# EAGLE schematic GoomWave (EAGLE 9.3.2)
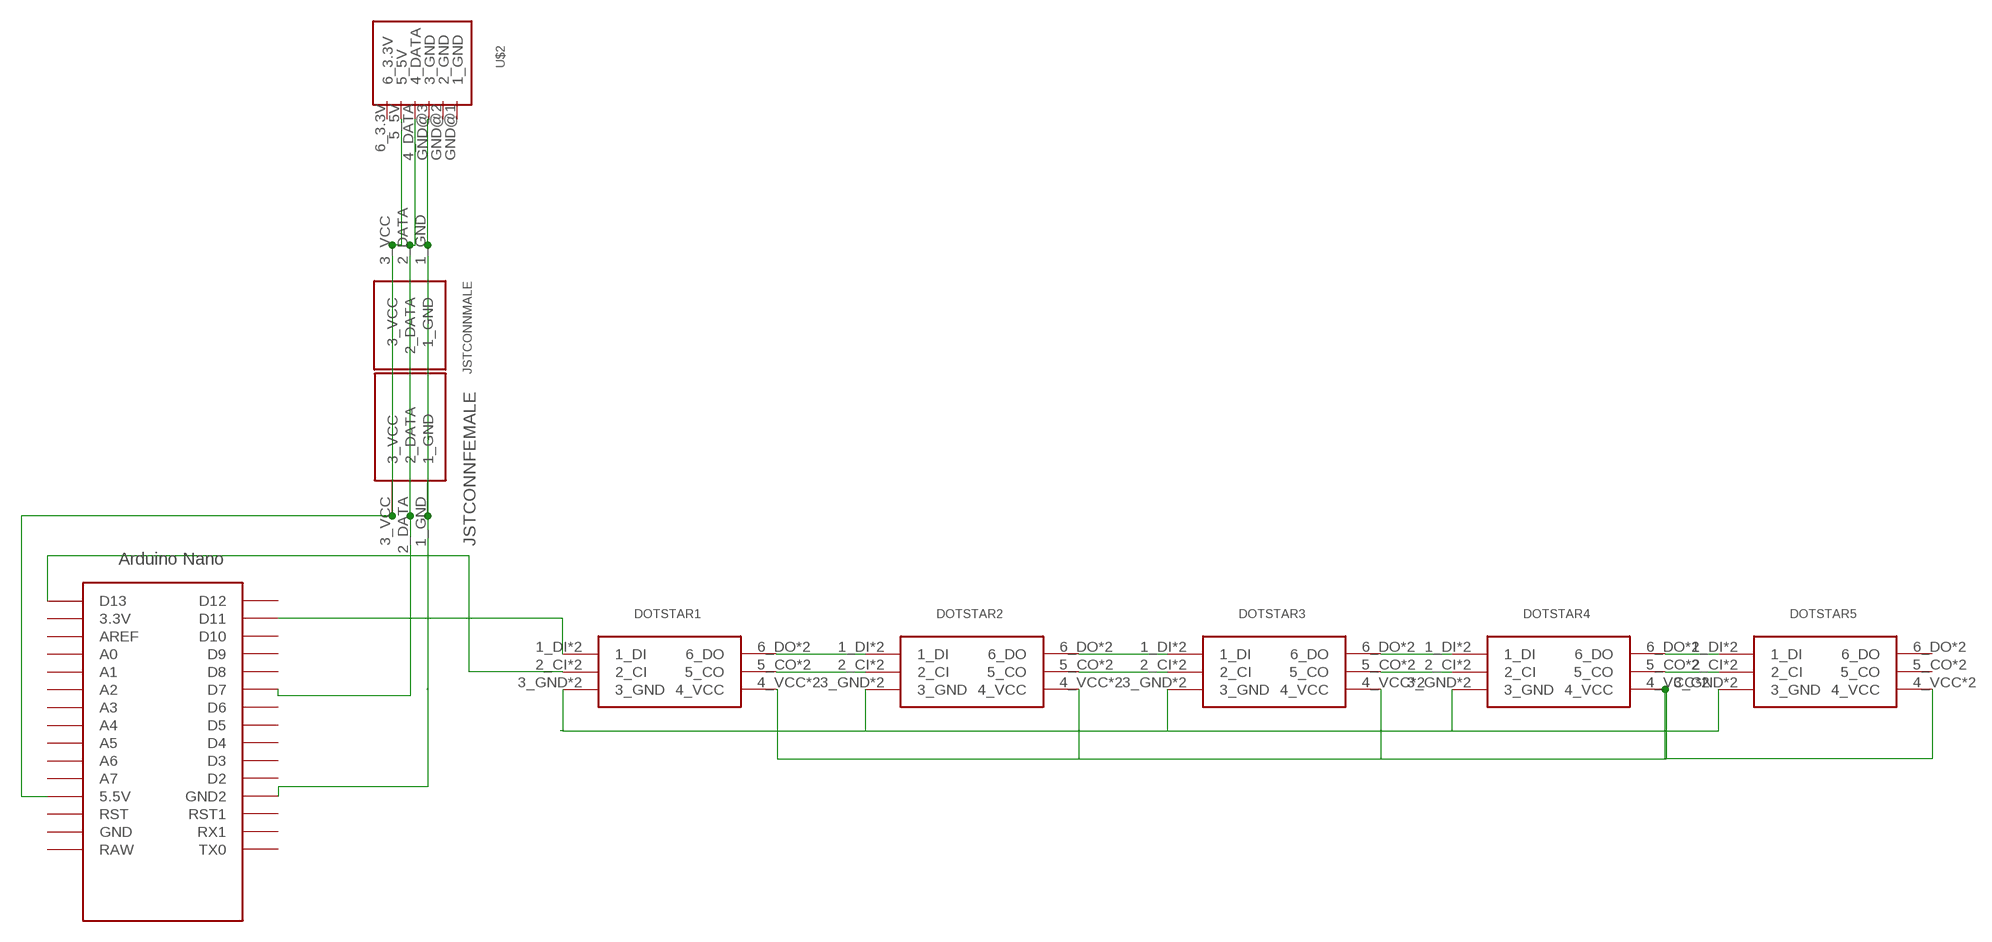
[diagram p0: schematic, sheet 1]

## Parts
DOTSTAR1  APA102  [APA102]
DOTSTAR2  APA102  [APA102]
DOTSTAR3  APA102  [APA102]
DOTSTAR4  APA102  [APA102]
DOTSTAR5  APA102  [APA102]
JSTCONNFEMALE  JSTCONNFEMALE  [JSTCONN]
JSTCONNMALE  JSTCONNMALE  [JSTCONN]
U$1  NANO  [NANO]
U$2  GCCHEADER  [GCC]

## Nets
N$3: JSTCONNFEMALE.2_DATA JSTCONNMALE.2_DATA U$1.D7 U$2.4_DATA
N$5: JSTCONNFEMALE.3_VCC JSTCONNMALE.3_VCC U$1.5V(5.5V) U$2.5_5V
N$6: JSTCONNFEMALE.1_GND JSTCONNMALE.1_GND U$1.GND1(GND2) U$2.GND@3(3_GND)
N$7: DOTSTAR1.3_GND DOTSTAR1.P$3(3_GND) DOTSTAR2.3_GND DOTSTAR2.P$3(3_GND) DOTSTAR3.3_GND DOTSTAR3.P$3(3_GND) DOTSTAR4.3_GND DOTSTAR4.P$3(3_GND) DOTSTAR5.3_GND DOTSTAR5.P$3(3_GND)
N$8: DOTSTAR1.2_CI DOTSTAR1.P$2(2_CI) U$1.D13
N$9: DOTSTAR1.1_DI DOTSTAR1.P$1(1_DI) U$1.D11
N$10: DOTSTAR1.6_DO DOTSTAR1.P$6(6_DO) DOTSTAR2.1_DI DOTSTAR2.P$1(1_DI)
N$11: DOTSTAR1.5_CO DOTSTAR1.P$5(5_CO) DOTSTAR2.2_CI DOTSTAR2.P$2(2_CI)
N$12: DOTSTAR1.4_VCC DOTSTAR1.P$4(4_VCC) DOTSTAR2.4_VCC DOTSTAR2.P$4(4_VCC) DOTSTAR3.4_VCC DOTSTAR3.P$4(4_VCC) DOTSTAR4.4_VCC DOTSTAR4.P$4(4_VCC) DOTSTAR5.4_VCC DOTSTAR5.P$4(4_VCC)
N$13: DOTSTAR2.6_DO DOTSTAR2.P$6(6_DO) DOTSTAR3.1_DI DOTSTAR3.P$1(1_DI)
N$14: DOTSTAR2.5_CO DOTSTAR2.P$5(5_CO) DOTSTAR3.2_CI DOTSTAR3.P$2(2_CI)
N$15: DOTSTAR3.6_DO DOTSTAR3.P$6(6_DO) DOTSTAR4.1_DI DOTSTAR4.P$1(1_DI)
N$16: DOTSTAR3.5_CO DOTSTAR3.P$5(5_CO) DOTSTAR4.2_CI DOTSTAR4.P$2(2_CI)
N$17: DOTSTAR4.6_DO DOTSTAR4.P$6(6_DO) DOTSTAR5.1_DI DOTSTAR5.P$1(1_DI)
N$18: DOTSTAR4.5_CO DOTSTAR4.P$5(5_CO) DOTSTAR5.2_CI DOTSTAR5.P$2(2_CI)
Unconnected: DOTSTAR5.5_CO DOTSTAR5.6_DO DOTSTAR5.P$5(5_CO) DOTSTAR5.P$6(6_DO) U$1.3.3V U$1.A0 U$1.A1 U$1.A2 U$1.A3 U$1.A4 U$1.A5 U$1.A6 U$1.A7 U$1.AREF U$1.D2 U$1.D3 U$1.D4 U$1.D5 U$1.D6 U$1.D8 U$1.D9 U$1.D10 U$1.D12 U$1.GND U$1.ICSP1 U$1.ICSP2 U$1.ICSP3 U$1.ICSP4 U$1.ICSP5 U$1.ICSP6 U$1.RAW U$1.RST U$1.RST1 U$1.RX1 U$1.TX0 U$2.6_3.3V U$2.GND@1(1_GND) U$2.GND@2(2_GND)

## Library data of the parts
DOTSTAR1-DOTSTAR5 = Apa102:APA102
JSTCONNFEMALE = Apa102:JSTCONNFEMALE
JSTCONNMALE = Apa102:JSTCONNMALE
U$1 = Arduino-clone:NANO: Arduino Nano
U$2 = Apa102:GCCHEADER